# EAGLE board Base Station v3b (EAGLE 9.4.2)
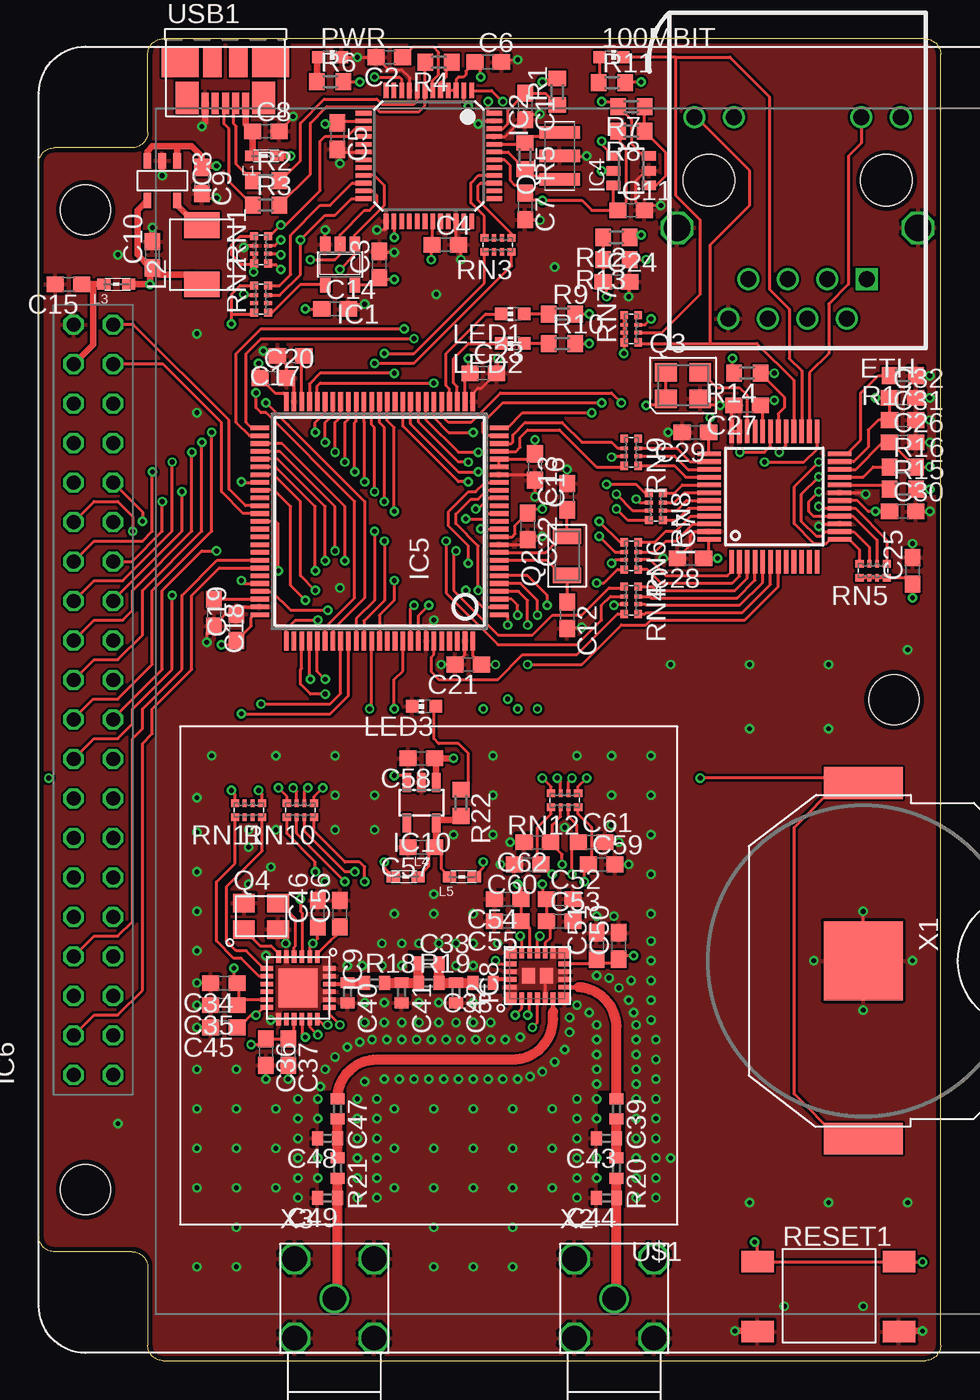
[diagram p4: board, top side]
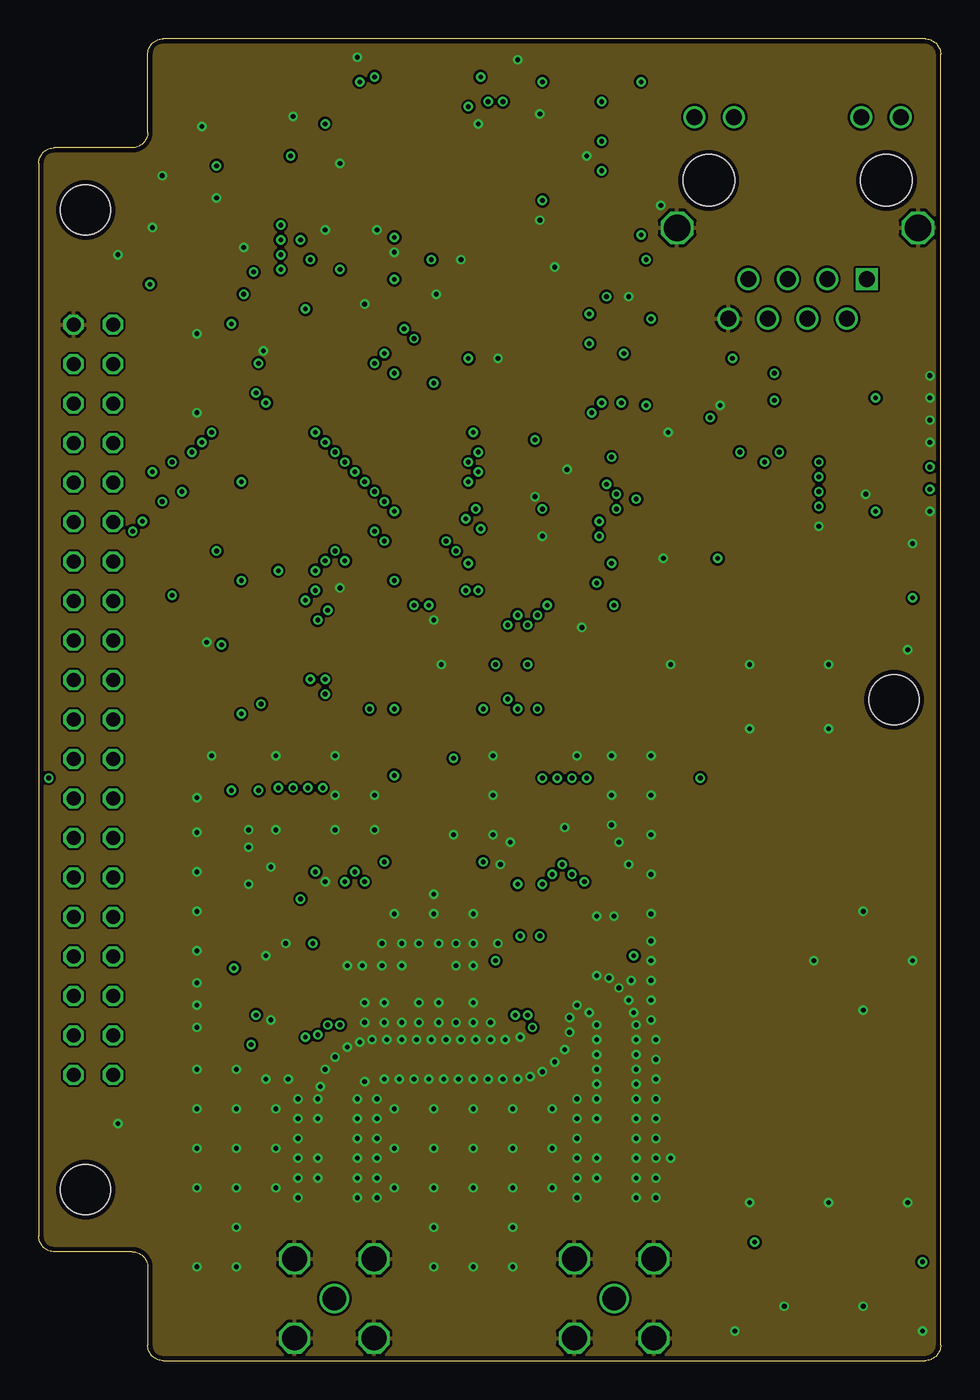
[diagram p5: board, inner layer GND]
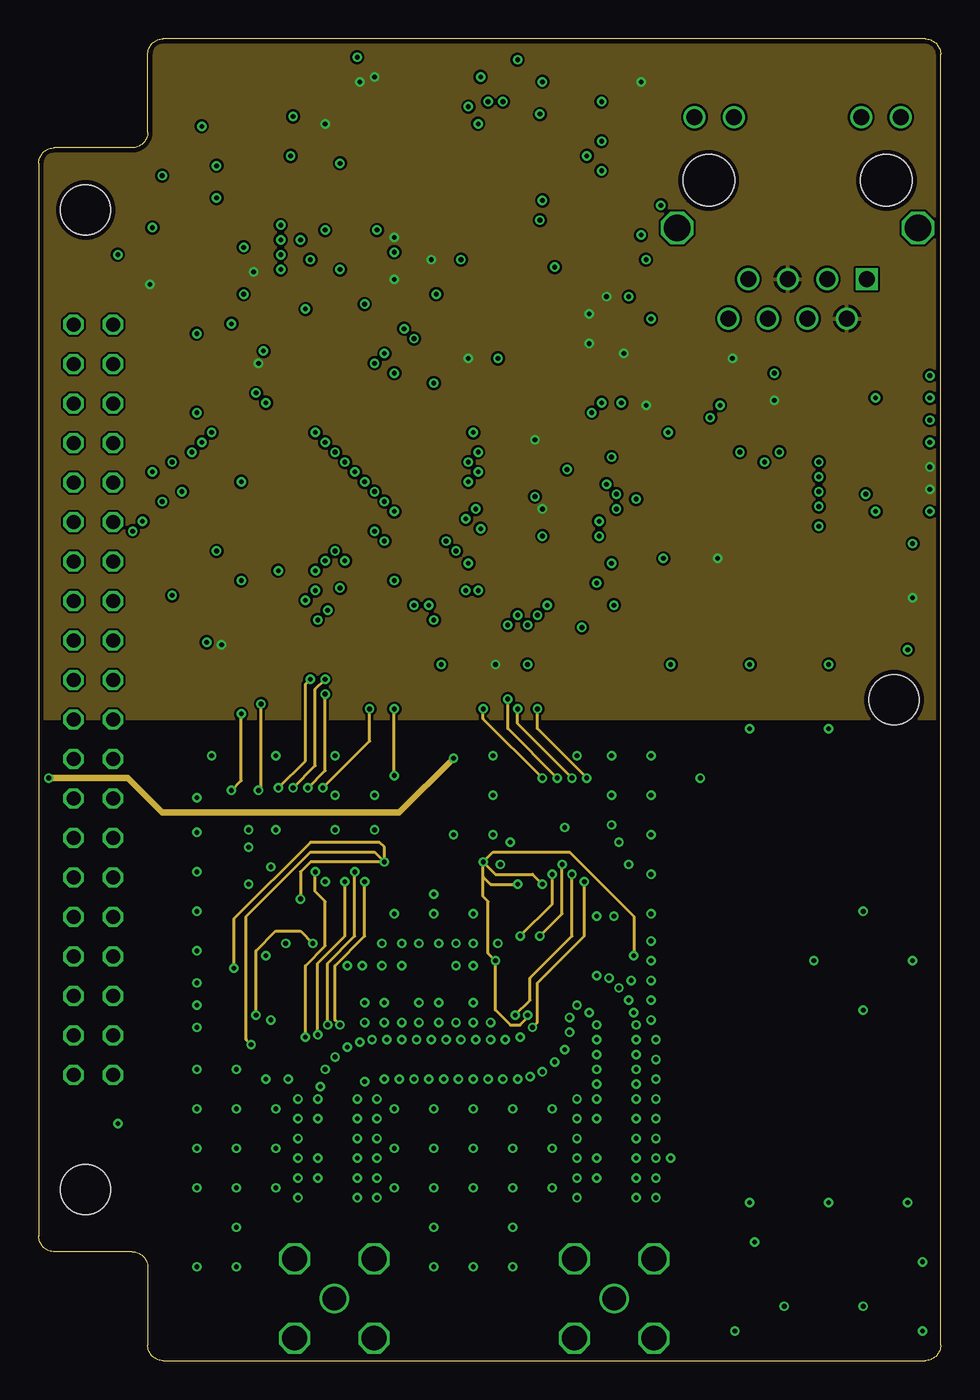
[diagram p6: board, inner layer PWR]
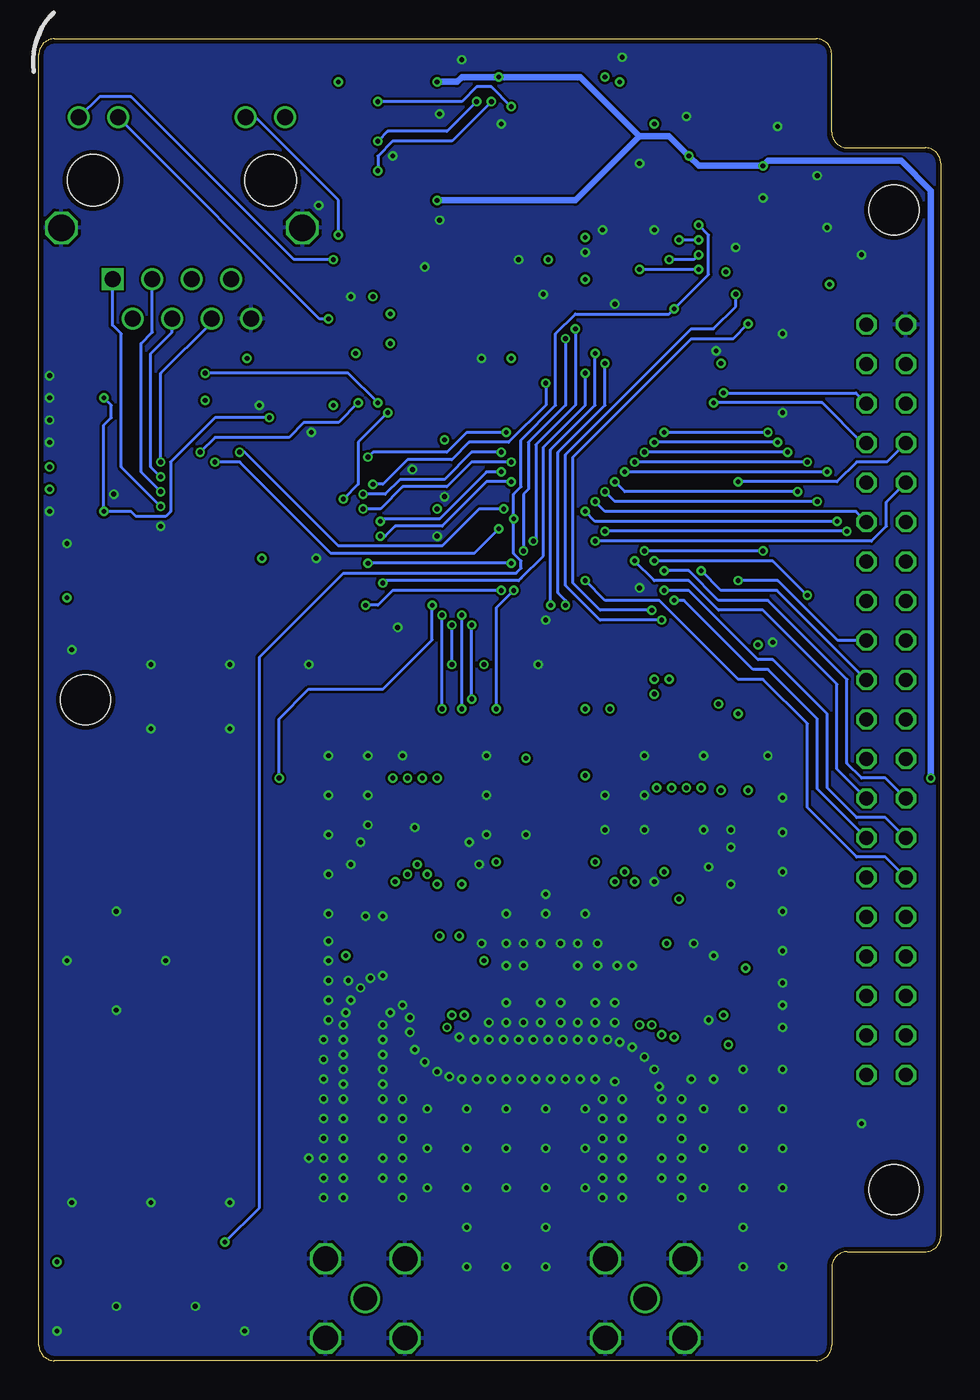
[diagram p7: board, bottom side, seen from below]

Size 58 x 85 mm. Coordinates in mm from the lower left corner, seen from the top.
Outline: 58,84 58,1 arc-90 57,0 8,0 arc-90 7,1 7,6 arc90 6,7 1,7 arc-90 0,8 0,77 arc-90 1,78 6,78 arc90 7,79 7,84 arc-90 8,85 57,85
Outline: 57,85 arc-90 58,84
Outline: 57,85 arc-90 58,84
Copper layers (1+2*15+16): HF 0.035mm / dielectric 0.38mm / GND 0.035mm / dielectric 0.71mm / PWR 0.035mm / dielectric 0.38mm / Signals 0.035mm
Design rules "PCB-POOL Standard_ML4 *": minimum track width 0.15mm, minimum drill 0.3mm, track to track 0.15mm, track to pad 0.15mm, pad to pad 0.15mm, via to via 0.15mm, smd to smd 0.15mm, copper to edge 0.3mm, drill to drill 0.2mm, minimum pad ring 0.2mm, minimum via ring 0.15mm, stop-mask expansion 0.075mm, vias tented up to drill 15mil, thermal gap 0.2mm
Net classes: 1 50Ohm: width 0.643 mm, clearance 0.35 mm
Holes 3.2 mm at 3,74 3,11 55,42.5
tKeepout: area -0.5,70.5 to 6.5,77.5; area -0.5,7.5 to 6.5,14.5; area 51.5,39 to 58.5,46
tRestrict: area 19.4,23.7 to 29.7,26.4; area 36,9.8 to 37.6,17.3; area 18.1,9.8 to 19.7,17.3

## Footprints (pad centres in the part's own frame; a part is rotated, then mirrored left to right if it is on the bottom)
CHIP-LED0603 = smd 0.8 x 0.8: A 0,-0.75; C 0,0.75
C0603 = smd 1.1 x 1: 1 -0.85,0; 2 0.85,0
C0402 = smd 0.7 x 0.9: 1 -0.65,0; 2 0.65,0
RJ45-LED = drill 1.016 square: 1 -4.445,6.35 | drill 1.016: 2 -3.175,8.89; 3 -1.905,6.35; 4 -0.635,8.89; 5 0.635,6.35; 6 1.905,8.89; 7 3.175,6.35; 8 4.445,8.89; 11 -6.629,-4.064; 12 -4.089,-4.064; 13 4.089,-4.064; 14 6.629,-4.064 | drill 1.7 octagon: 9 -7.747,3.048; 10 7.747,3.048 | hole 3.3: -5.715,0; 5.715,0
SOT23-5 = smd 0.69 x 0.99: 1 -0.95,-1.29; 2 0,-1.29; 3 0.95,-1.29; 4 0.95,1.3; 5 -0.95,1.3
LQFP48-ST = smd 1 x 0.3: 1 -4.2,2.75; 2 -4.2,2.25; 3 -4.2,1.75; 4 -4.2,1.25; 5 -4.2,0.75; 6 -4.2,0.25; 7 -4.2,-0.25; 8 -4.2,-0.75; 9 -4.2,-1.25; 10 -4.2,-1.75; 11 -4.2,-2.25; 12 -4.2,-2.75; 25 4.2,-2.75; 26 4.2,-2.25; 27 4.2,-1.75; 28 4.2,-1.25; 29 4.2,-0.75; 30 4.2,-0.25; 31 4.2,0.25; 32 4.2,0.75; 33 4.2,1.25; 34 4.2,1.75; 35 4.2,2.25; 36 4.2,2.75 | smd 0.3 x 1: 13 -2.75,-4.2; 14 -2.25,-4.2; 15 -1.75,-4.2; 16 -1.25,-4.2; 17 -0.75,-4.2; 18 -0.25,-4.2; 19 0.25,-4.2; 20 0.75,-4.2; 21 1.25,-4.2; 22 1.75,-4.2; 23 2.25,-4.2; 24 2.75,-4.2; 37 2.75,4.2; 38 2.25,4.2; 39 1.75,4.2; 40 1.25,4.2; 41 0.75,4.2; 42 0.25,4.2; 43 -0.25,4.2; 44 -0.75,4.2; 45 -1.25,4.2; 46 -1.75,4.2; 47 -2.25,4.2; 48 -2.75,4.2
SOT23-5' = smd 1.016 x 0.508: 1 -1.27,0.953; 2 -1.27,0; 3 -1.27,-0.953; 4 1.27,-0.953; 5 1.27,0.953
SOT23-6 = smd 0.6 x 0.9: 1 -0.95,-1.15; 2 0,-1.15; 3 0.95,-1.15; 4 0.95,1.15; 5 0,1.15; 6 -0.95,1.15
LQFP100-ST = smd 0.3 x 1.2: 1 -6,-7.7; 2 -5.5,-7.7; 3 -5,-7.7; 4 -4.5,-7.7; 5 -4,-7.7; 6 -3.5,-7.7; 7 -3,-7.7; 8 -2.5,-7.7; 9 -2,-7.7; 10 -1.5,-7.7; 11 -1,-7.7; 12 -0.5,-7.7; 13 0,-7.7; 14 0.5,-7.7; 15 1,-7.7; 16 1.5,-7.7; 17 2,-7.7; 18 2.5,-7.7; 19 3,-7.7; 20 3.5,-7.7; 21 4,-7.7; 22 4.5,-7.7; 23 5,-7.7; 24 5.5,-7.7; 25 6,-7.7; 51 6,7.7; 52 5.5,7.7; 53 5,7.7; 54 4.5,7.7; 55 4,7.7; 56 3.5,7.7; 57 3,7.7; 58 2.5,7.7; 59 2,7.7; 60 1.5,7.7; 61 1,7.7; 62 0.5,7.7; 63 0,7.7; 64 -0.5,7.7; 65 -1,7.7; 66 -1.5,7.7; 67 -2,7.7; 68 -2.5,7.7; 69 -3,7.7; 70 -3.5,7.7; 71 -4,7.7; 72 -4.5,7.7; 73 -5,7.7; 74 -5.5,7.7; 75 -6,7.7 | smd 1.2 x 0.3: 26 7.7,-6; 27 7.7,-5.5; 28 7.7,-5; 29 7.7,-4.5; 30 7.7,-4; 31 7.7,-3.5; 32 7.7,-3; 33 7.7,-2.5; 34 7.7,-2; 35 7.7,-1.5; 36 7.7,-1; 37 7.7,-0.5; 38 7.7,0; 39 7.7,0.5; 40 7.7,1; 41 7.7,1.5; 42 7.7,2; 43 7.7,2.5; 44 7.7,3; 45 7.7,3.5; 46 7.7,4; 47 7.7,4.5; 48 7.7,5; 49 7.7,5.5; 50 7.7,6; 76 -7.7,6; 77 -7.7,5.5; 78 -7.7,5; 79 -7.7,4.5; 80 -7.7,4; 81 -7.7,3.5; 82 -7.7,3; 83 -7.7,2.5; 84 -7.7,2; 85 -7.7,1.5; 86 -7.7,1; 87 -7.7,0.5; 88 -7.7,0; 89 -7.7,-0.5; 90 -7.7,-1; 91 -7.7,-1.5; 92 -7.7,-2; 93 -7.7,-2.5; 94 -7.7,-3; 95 -7.7,-3.5; 96 -7.7,-4; 97 -7.7,-4.5; 98 -7.7,-5; 99 -7.7,-5.5; 100 -7.7,-6
CP11009-THX = drill 0.9 octagon: 1 1.27,-24.13; 2 1.27,-21.59; 3 1.27,-19.05; 4 1.27,-16.51; 5 1.27,-13.97; 6 1.27,-11.43; 7 1.27,-8.89; 8 1.27,-6.35; 9 1.27,-3.81; 10 1.27,-1.27; 11 1.27,1.27; 12 1.27,3.81; 13 1.27,6.35; 14 1.27,8.89; 15 1.27,11.43; 16 1.27,13.97; 17 1.27,16.51; 18 1.27,19.05; 19 1.27,21.59; 20 1.27,24.13; 21 -1.27,-24.13; 22 -1.27,-21.59; 23 -1.27,-19.05; 24 -1.27,-16.51; 25 -1.27,-13.97; 26 -1.27,-11.43; 27 -1.27,-8.89; 28 -1.27,-6.35; 29 -1.27,-3.81; 30 -1.27,-1.27; 31 -1.27,1.27; 32 -1.27,3.81; 33 -1.27,6.35; 34 -1.27,8.89; 35 -1.27,11.43; 36 -1.27,13.97; 37 -1.27,16.51; 38 -1.27,19.05; 39 -1.27,21.59; 40 -1.27,24.13
LQFP48 = smd 1.5 x 0.3: 1 -4.2,2.75; 2 -4.2,2.25; 3 -4.2,1.75; 4 -4.2,1.25; 5 -4.2,0.75; 6 -4.2,0.25; 7 -4.2,-0.25; 8 -4.2,-0.75; 9 -4.2,-1.25; 10 -4.2,-1.75; 11 -4.2,-2.25; 12 -4.2,-2.75; 25 4.2,-2.75; 26 4.2,-2.25; 27 4.2,-1.75; 28 4.2,-1.25; 29 4.2,-0.75; 30 4.2,-0.25; 31 4.2,0.25; 32 4.2,0.75; 33 4.2,1.25; 34 4.2,1.75; 35 4.2,2.25; 36 4.2,2.75 | smd 0.3 x 1.5: 13 -2.75,-4.2; 14 -2.25,-4.2; 15 -1.75,-4.2; 16 -1.25,-4.2; 17 -0.75,-4.2; 18 -0.25,-4.2; 19 0.25,-4.2; 20 0.75,-4.2; 21 1.25,-4.2; 22 1.75,-4.2; 23 2.25,-4.2; 24 2.75,-4.2; 37 2.75,4.2; 38 2.25,4.2; 39 1.75,4.2; 40 1.25,4.2; 41 0.75,4.2; 42 0.25,4.2; 43 -0.25,4.2; 44 -0.75,4.2; 45 -1.25,4.2; 46 -1.75,4.2; 47 -2.25,4.2; 48 -2.75,4.2
SMCM-22 = smd 0.75 x 0.75: 1 -1.475,1.725; 7 -1.475,-1.725; 12 1.475,-1.725; 18 1.475,1.725 | smd 0.75 x 0.3: 2 -1.475,1; 3 -1.475,0.5; 4 -1.475,0; 5 -1.475,-0.5; 6 -1.475,-1; 13 1.475,-1; 14 1.475,-0.5; 15 1.475,0; 16 1.475,0.5; 17 1.475,1 | smd 0.3 x 0.75: 8 -0.75,-1.725; 9 -0.25,-1.725; 10 0.25,-1.725; 11 0.75,-1.725; 19 0.75,1.725; 20 0.25,1.725; 21 -0.25,1.725; 22 -0.75,1.725 | smd 1 x 0.85: PAD1 0,0.575; PAD2 0,-0.575
QFN24L = smd 0.8 x 0.3: 1 -2,1.25; 2 -2,0.75; 3 -2,0.25; 4 -2,-0.25; 5 -2,-0.75; 6 -2,-1.25; 13 2,-1.25; 14 2,-0.75; 15 2,-0.25; 16 2,0.25; 17 2,0.75; 18 2,1.25 | smd 0.3 x 0.8: 7 -1.25,-2; 8 -0.75,-2; 9 -0.25,-2; 10 0.25,-2; 11 0.75,-2; 12 1.25,-2; 19 1.25,2; 20 0.75,2; 21 0.25,2; 22 -0.25,2; 23 -0.75,2; 24 -1.25,2 | smd 2.5 x 2.5: PAD 0,0
SOT23-5L = smd 0.55 x 1.2: 1 -0.95,-1.3; 2 0,-1.3; 3 0.95,-1.3; 4 0.95,1.3; 5 -0.95,1.3
0603 = smd 0.85 x 0.7: 1 -0.9,0; 2 0.7,0
IHLP1616 = smd 1.651 x 2.286: P$1 -1.905,0; P$2 1.905,0
CSTCR6M = smd 0.8 x 2.6: 1 -1.5,0; 2 0,0; 3 1.5,0
CRYSTAL-07W = smd 1 x 1.8: 1 -1.25,0; 2 1.25,0
7X = smd 1.4 x 1.2: 1 -1.1,-0.85; 2 1.1,-0.85; 3 1.1,0.85; 4 -1.1,0.85
CRYSTAL-7M = smd 1.4 x 1.2: 1 -1.1,-0.85; 2 1.1,-0.85; 3 1.1,0.85; 4 -1.1,0.85
R0603 = smd 1 x 1.1: 1 -0.85,0; 2 0.85,0
R0402 = smd 0.7 x 0.9: 1 -0.65,0; 2 0.65,0
BUTTON4 = smd 1.4 x 2.1: 1 4.5,9.1; 2 4.5,0; 3 0,9.1; 4 0,0
EXB28V = smd 0.525 x 0.5: 1 -0.875,-0.45; 4 0.875,-0.45; 5 0.875,0.45; 8 -0.875,0.45 | smd 0.25 x 0.5: 2 -0.25,-0.45; 3 0.25,-0.45; 6 0.25,0.45; 7 -0.25,0.45
USB-BMICRO = smd 0.45 x 1.38: 1 1.3,-2.66; 2 0.65,-2.66; 3 0,-2.66; 4 -0.65,-2.66; 5 -1.3,-2.66 | smd 1.175 x 1.9: P$1 0.838,0; P$2 -0.838,0 | smd 2.375 x 1.9: P$3 2.913,0; P$4 -2.913,0 | smd 1.475 x 2.1: P$5 -2.462,-2.3; P$6 2.462,-2.3
CR2025 = smd 5.08 x 5.08: GND 0,0 | smd 2.032 x 5.08: POS1 -11.43,0; POS2 11.43,0
ANT-SMA-RA = drill 1.5: C 0,0 | drill 1.6 octagon: GND1 -2.55,2.55; GND2 2.55,2.55; GND3 2.55,-2.55; GND4 -2.55,-2.55

## Placement (x,y rotation side)
100MBIT  gr  [CHIP-LED0603]  36.83,83.82 270 top
C1  100n  [C0603]  31.27,80.64 270 top
C2  100n  [C0603]  22.54,83.82 180 top
C3  100n  [C0603]  21.91,70.48 90 top
C4  100n  [C0603]  26.15,71.75 0 top
C5  100n  [C0603]  19.21,78.74 270 top
C6  100n  [C0603]  28.89,83.5 0 top
C7  100n  [C0603]  31.27,74.22 270 top
C8  100n  [C0603]  14.61,79.06 0 top
C9  10u  [C0603]  10.48,75.88 270 top
C10  10u  [C0603]  7.3,71.12 90 top
C11  100n  [C0603]  38.1,73.98 0 top
C12  3p  [C0603]  33.97,47.94 270 top
C13  3p  [C0603]  33.97,55.56 90 top
C14  100n  [C0603]  19.05,67.63 0 top
C15  10u  [C0603]  1.91,69.22 180 top
C16  100n  [C0603]  31.91,57.47 270 top
C17  10u  [C0603]  16.19,64.61 180 top
C18  10u  [C0603]  11.27,48.1 270 top
C19  100n  [C0603]  12.7,47.15 90 top
C20  100n  [C0603]  15.08,63.18 0 top
C21  100n  [C0603]  27.62,44.77 180 top
C22  100n  [C0603]  31.43,53.66 270 top
C23  100n  [C0603]  28.57,63.5 0 top
C24  100n  [C0603]  37.15,69.37 0 top
C25  100n  [C0603]  56.2,50.8 90 top
C26  100n  [C0603]  55.56,59.05 0 top
C27  100n  [C0603]  45.56,61.44 180 top
C28  100n  [C0603]  41.91,51.59 180 top
C29  100n  [C0603]  42.23,59.69 180 top
C30  100n  [C0603]  55.56,54.61 0 top
C31  100n  [C0603]  55.56,60.48 0 top
C32  10u  [C0603]  55.56,61.91 0 top
C33  0p5  [C0402]  25.08,25.56 0 top
C34  100n  [C0603]  11.91,24.29 180 top
C35  1n  [C0603]  11.91,22.86 180 top
C36  100n  [C0603]  14.61,19.84 270 top
C37  1n  [C0603]  16.03,19.84 270 top
C38  100p  [C0402]  28.58,24.29 180 top
C39  47p  [C0402]  37.15,16.19 270 top
C40  NA  [C0402]  19.84,23.65 270 top
C41  1p2  [C0402]  23.34,23.65 270 top
C42  1p2  [C0402]  26.83,23.65 270 top
C43  NA  [C0402]  36.51,14.29 180 top
C44  0p5  [C0402]  36.51,10.48 180 top
C45  1u  [C0603]  11.91,21.43 180 top
C46  10n  [C0603]  17.94,28.73 90 top
C47  47p  [C0402]  19.21,16.19 270 top
C48  NA  [C0402]  18.57,14.29 180 top
C49  0p7  [C0402]  18.57,10.48 180 top
C50  100n  [C0603]  37.31,26.67 90 top
C51  1n  [C0603]  35.88,26.67 90 top
C52  100n  [C0603]  33.5,29.69 0 top
C53  1n  [C0603]  33.5,28.26 0 top
C54  100n  [C0603]  30.16,29.69 180 top
C55  1n  [C0603]  30.16,28.26 180 top
C56  10n  [C0603]  19.37,28.73 90 top
C57  10u  [C0603]  24.61,33.02 180 top
C58  10u  [C0603]  24.61,38.73 180 top
C59  1n  [C0603]  36.2,31.91 0 top
C60  1n  [C0603]  31.43,31.91 180 top
C61  1n  [C0603]  35.56,33.34 0 top
C62  1n  [C0603]  32.07,33.34 180 top
ETH  SI-60062-F  [RJ45-LED]  48.8,75.9 180 top
IC1  74LVC1G125DBV  [SOT23-5]  19.37,70.48 180 top
IC2  FT2232ST  [LQFP48-ST]  25.08,77.47 270 top
IC3  SC189-3.3  [SOT23-5']  7.94,75.88 270 top
IC4  93C76B  [SOT23-6]  38.1,76.52 90 top
IC5  STM32F767VIT6  [LQFP100-ST]  21.91,53.98 90 top
IC6  CP11009  [CP11009-THX]  3.5,42.5 180 top
IC7  DP83848CVV  [LQFP48]  47.31,55.56 90 top
IC8  SKY66112  [SMCM-22]  32.07,24.77 90 top
IC9  SX1280  [QFN24L]  16.67,23.97 270 top
IC10  LP5907MFX-3.3  [SOT23-5L]  24.61,35.88 180 top
L1  120R  [0603]  14.61,77.47 0 top
L2  2u2  [IHLP1616]  10.48,71.12 90 top
L3  120R  [0603]  5.08,69.22 0 top
L4  120R  [0603]  23.5,31.11 180 top
L5  120R  [0603]  27.3,31.11 0 top
LED1  rd  [CHIP-LED0603]  30.48,67.31 90 top
LED2  gr  [CHIP-LED0603]  30.48,65.41 90 top
LED3  gr  [CHIP-LED0603]  24.77,42.07 90 top
PWR  gr  [CHIP-LED0603]  18.73,83.82 270 top
Q1  CSTCR6M00G55-R0  [CSTCR6M]  33.5,77.47 90 top
Q2  ABS07W-32.768KHZ  [CRYSTAL-07W]  33.97,51.75 90 top
Q3  25MHz  [7X]  41.43,62.71 0 top
Q4  FL520WFMT1  [CRYSTAL-7M]  14.29,28.57 0 top
R1  1k  [R0603]  33.34,81.6 90 top
R2  33  [R0603]  14.61,75.88 0 top
R3  33  [R0603]  14.61,74.3 0 top
R4  1k5  [R0603]  25.72,83.5 180 top
R5  1M  [R0603]  31.27,77.47 270 top
R6  1k  [R0603]  18.73,82.23 0 top
R7  1k  [R0603]  38.1,80.64 180 top
R8  4k87  [R0603]  38.1,79.06 180 top
R9  1k  [R0603]  33.66,67.31 0 top
R10  1k  [R0603]  33.66,65.41 0 top
R11  1k  [R0603]  36.86,82.19 0 top
R12  1k  [R0603]  37.15,72.23 180 top
R13  1k  [R0603]  37.15,70.8 180 top
R14  1k5  [R0603]  45.56,63.5 180 top
R15  2k2  [R0603]  55.56,56.04 0 top
R16  2k2  [R0603]  55.56,57.47 0 top
R17  4k87  [R0603]  55.56,63.34 180 top
R18  3n  [R0402]  21.59,24.29 0 top
R19  2n4  [R0402]  25.08,24.29 0 top
R20  2n4  [R0402]  37.15,12.38 270 top
R21  3n  [R0402]  19.21,12.38 270 top
R22  1k  [R0603]  27.15,35.88 270 top
RESET1  BUTTON4  [BUTTON4]  46.22,6.37 270 top
RN1  10k  [EXB28V]  14.29,71.44 90 top
RN2  100  [EXB28V]  14.29,68.26 90 top
RN3  100  [EXB28V]  29.53,71.75 180 top
RN4  100  [EXB28V]  38.1,48.9 270 top
RN5  100  [EXB28V]  53.66,50.8 180 top
RN6  100  [EXB28V]  38.1,51.75 270 top
RN7  N/A  [EXB28V]  38.1,66.36 90 top
RN8  100  [EXB28V]  39.69,54.93 270 top
RN9  100  [EXB28V]  38.1,58.42 270 top
RN10  100  [EXB28V]  16.83,35.4 180 top
RN11  100  [EXB28V]  13.49,35.4 180 top
RN12  100  [EXB28V]  33.81,36.04 180 top
U$1  BMI-S-204-F  [SHIELD-32MM]  25.08,24.77 180 top
USB1  USB-BU  [USB-BMICRO]  12,83.5 0 top
X1  3034TR  [CR2025]  53.02,25.72 270 top
X2  [ANT-SMA-RA]  37,4 0 top
X3  [ANT-SMA-RA]  19,4 0 top

## Tracks (layer width: path | path; a pad name or v marks a point on that pad's centre or on a via)
25MHZ  (via drill 0.3)
  HF 0.203: IC5.12 28.44,53.48 v28.42,53.5 | v46.67,57.78 49.21,57.78 50.06,58.63 IC7.25
  Signals 0.203: v28.42,53.5 30,51.91 39.21,51.91 45.09,57.78 v46.67,57.78
+3V3  (via drill 0.3)
  HF 0.203: IC7.22 52.55,57.31 54.29,59.05 C26.1 54.77,59.05 56.36,57.47 R16.2 v57.31,57.47 | IC7.48 43.11,51.62 C28.1 | C28.1 v43.66,51.59 | C28.1 | v36.51,68.42 36.51,68.84 C24.1 R13.2 R12.2 | v47.31,61.75 46.73,61.75 C27.1 46.56,61.29 IC7.32 | v37.62,64.77 37.62,65.46 RN7.8 RN7.7 RN7.6 RN7.5 | Q3.4 Q3.1 39.91,61.44 v39.05,61.44 | C25.1 56.09,50.16 | C25.1 56.28,50.03 56.4,49.91 | IC2.10 23.33,82.39 23.18,82.55 | IC2.14 19.44,79.72 C5.1 | C5.1 19.37,79.67 | IC2.31 25.33,71.79 C4.1 25.24,71.69 v25.24,70.8 | IC2.26 22.86,73.24 v22.86,72.23 | 23.18,82.55 | v21.59,82.55 23.18,82.55 | R15.2 v57.31,56.04 | R9.2 v35.4,67.31 | R10.2 v35.4,65.41 | C5.1 19.38,79.69 | v18.41,79.53 19.15,79.53 C5.1 | RN1.5 12.94,72.31 12.38,71.75 12.38,71.12 13.02,70.48 13.76,70.48 | 13.76,70.48 RN1.8 RN1.7 | 13.76,70.48 13.81,70.43 v13.81,70.01 | IC1.5 21.46,69.19 C3.1 22.01,69.53 v22.86,69.53 | v44.61,64.45 44.61,63.6 R14.2 | C16.1 31.57,57.98 IC5.21 IC5.20 | C16.1 | C16.1 v31.91,59.21 | IC5.11 30.43,52.98 30.64,53.18 30.64,53.71 C22.1 31.54,54.77 v32.38,54.77 | IC5.75 13.84,47.98 13.65,47.78 13.65,47.25 C19.1 12.44,46.04 v11.75,46.04 | IC5.50 15.91,62.04 15.72,62.23 15.18,62.23 C20.1 14.13,63.28 v14.13,64.14 | IC5.27 27.41,63.18 C23.1 27.62,63.6 v27.62,64.45 | C25.1 v56.2,49.05 | IC5.100 27.91,45.33 C21.1 v29.37,44.77 | R11.2 37.75,82.23 v38.73,82.23 | C25.1 55.8,50.35 RN5.8 RN5.7 RN5.6 RN5.5 | R6.2 v20.64,82.23
  HF 0.406: L2.P$1 9.84,69.85 7.72,69.85 C10.1 | C10.1 7.2,70.27 6.35,71.12 6.35,73.98 IC3.4 | C10.1 7.14,70.11 v7.14,69.22 L3.2 | L3.2
  pour PWR: 0,85.09 58.74,85.09 58.74,41.27 0,41.27
+5V  (via drill 0.3)
  HF 0.203: IC2.42 29.94,77.22 30.32,76.83 30.32,75.88 30.64,75.56 30.77,75.56 C7.1 31.72,74.61 v32.38,74.61 34.92,74.61 35.56,73.98 C11.1 | IC2.4 IC2.3 26.83,82.39 26.99,82.55 27.3,82.55 27.46,82.71 27.46,82.92 C6.1 28.42,83.13 v28.42,82.55 | IC4.6 36.95,74.28 C11.1 | C11.1 37.78,74.51 37.78,77.95 37.41,78.32 37.41,78.9 R8.2
  HF 0.406: C7.1 31.56,74.77 | 33.23,82.23 R1.2 33.12,82.23 v32.38,82.23 | v26.67,38.73 C58.1 25.56,38.63 IC10.1 | v16.19,77.47 L1.2 | IC3.3 6.99,77.79 7.3,78.11 8.89,78.11 | 8.89,78.11 9.84,78.11 10.48,77.47 C9.1 10.58,76.83 v11.43,76.83 | 8.89,78.11 IC3.1
  PWR 0.406: v26.67,38.73 23.18,35.24 7.94,35.24 5.71,37.47 v0.64,37.47
  Signals 0.406: v32.38,82.23 31.11,82.23 30.8,82.55 v28.42,82.55 | v28.42,82.55 | v28.42,82.55 23.18,82.55 19.37,78.74 | 19.37,78.74 17.46,78.74 v16.19,77.47 15.56,76.83 v11.43,76.83 11.11,77.15 2.54,77.15 0.64,75.25 v0.64,37.47 | v32.38,74.61 23.5,74.61 19.37,78.74
ANTS  (via drill 0.3)
  HF 0.203: IC8.4 32.07,21.75 v31.75,21.43 | v35.08,30.8 35.08,31.61 C59.1 35.56,31.61 35.56,34.29 34.69,35.16 RN12.8
  PWR 0.203: v31.75,21.43 32.07,21.75 32.07,24.29 35.08,27.3 v35.08,30.8
CPS  (via drill 0.3)
  HF 0.203: IC8.15 32.07,27.15 v32.23,27.3 | v33.66,31.91 33.66,32.56 C62.1 33.02,33.35 33.02,34.45 33.56,34.99 RN12.6
  PWR 0.203: v32.23,27.3 33.66,28.73 v33.66,31.91
CRX  (via drill 0.3)
  HF 0.203: IC8.2 31.07,22.65 v30.64,22.23 | v34.29,31.27 34.29,33.03 C61.1 34.61,33.35 34.61,34.45 34.06,34.99 RN12.7
  PWR 0.203: v30.64,22.23 31.59,23.18 31.59,24.61 34.29,27.3 v34.29,31.27
CTX  (via drill 0.3)
  HF 0.203: IC8.17 31.07,27.19 v30.96,27.3 | v33.02,31.27 33.02,31.29 C60.1 32.07,31.61 32.07,34.29 32.94,35.16 RN12.5
  PWR 0.203: v30.96,27.3 33.02,29.37 v33.02,31.27
FMC_A16  (via drill 0.3)
  HF 0.203: IC5.58 13.06,56.48 v13.02,56.52
  Signals 0.203: v13.02,56.52 6.67,56.52 5.4,57.78 3.46,57.78 IC6.4
FMC_D0
  HF 0.203: IC5.61 13.29,54.98 12.22,56.04 12.22,60.48 6.08,66.63 IC6.21
FMC_D1
  HF 0.203: IC5.62 13.15,54.48 11.75,55.88 11.75,60.33 7.98,64.09 IC6.22
FMC_D2  (via drill 0.3)
  HF 0.203: IC5.81 18.41,47.14 19.53,48.26 20.32,49.05 20.32,55.24 14.61,60.96 14.29,60.96 13.97,61.28 v13.97,62.23
  Signals 0.203: v13.97,62.23 5.45,62.23 IC6.23
FMC_D3  (via drill 0.3)
  HF 0.203: IC5.82 18.91,47.01 20.95,49.05 20.95,55.24 16.83,59.37 | 16.83,59.37 | 16.03,60.17 16.83,59.37 | 16.03,60.17 | v14.61,61.59 16.03,60.17
  Signals 0.203: IC6.24 5.04,59.01 7.62,61.59 v14.61,61.59
FMC_D4  (via drill 0.3)
  HF 0.203: IC5.37 22.41,60.46 22.86,60.01 v22.86,54.61 | v6.67,53.98 6.67,54.57 IC6.25
  Signals 0.203: v22.86,54.61 22.23,53.98 v6.67,53.98
FMC_D5  (via drill 0.3)
  HF 0.203: IC5.38 21.91,60.33 22.23,60.01 v22.23,55.24
  Signals 0.203: v22.23,55.24 21.59,54.61 5.45,54.61 IC6.26
FMC_D6  (via drill 0.3)
  HF 0.203: IC5.39 21.41,60.19 21.59,60.01 v21.59,55.88 | IC6.27 5.99,51.39 7.94,53.34 v7.94,55.24
  Signals 0.203: v21.59,55.88 20.95,55.24 v7.94,55.24
FMC_D7  (via drill 0.3)
  HF 0.203: IC5.40 20.91,60.37 20.95,60.33 v20.95,56.52 | IC6.28 4.82,48.9 4.76,48.9 9.21,53.34 v9.21,55.88
  Signals 0.203: v20.95,56.52 20.32,55.88 v9.21,55.88
FMC_D8  (via drill 0.3)
  HF 0.203: IC5.41 20.41,60.41 20.32,60.33 v20.32,57.15 | IC6.7 3.54,52.7 6.67,52.7 7.3,53.34 v7.3,57.15
  Signals 0.203: v7.3,57.15 v20.32,57.15
FMC_D9  (via drill 0.3)
  HF 0.203: IC5.42 19.91,60.55 19.68,60.33 v19.68,57.78 | IC6.8 3.54,50.16 5.4,50.16 8.57,53.34 v8.57,57.78
  Signals 0.203: v8.57,57.78 v19.68,57.78
FMC_D10  (via drill 0.3)
  HF 0.203: IC5.43 19.41,60.68 19.05,60.33 v19.05,58.42 | IC6.9 3.54,47.62 5.4,47.62 6.03,48.26 6.03,49.53 9.84,53.34 v9.84,58.42
  Signals 0.203: v9.84,58.42 v19.05,58.42
FMC_D11  (via drill 0.3)
  HF 0.203: IC5.44 18.91,60.82 18.41,60.33 v18.41,59.05 | IC6.10 3.54,45.09 5.08,45.09 6.67,46.67 6.67,49.53 10.48,53.34 v10.48,59.05
  Signals 0.203: v10.48,59.05 v18.41,59.05
FMC_D12  (via drill 0.3)
  HF 0.203: IC5.45 18.41,60.95 17.78,60.33 v17.78,59.69 | IC6.11 2.23,41.28 3.49,42.55 5.08,42.55 7.3,44.77 7.3,49.53 11.11,53.34 v11.11,59.69
  Signals 0.203: v11.11,59.69 v17.78,59.69
FMC_D13  (via drill 0.3)
  HF 0.203: IC5.55 15.37,57.98 18.41,54.93 v18.41,51.44 | v8.57,49.21 8.57,44.45 6.03,41.91 6.03,40.96 5.08,40.01 3.54,40.01 IC6.12
  Signals 0.203: v18.41,51.44 10.79,51.44 v8.57,49.21
FMC_D14  (via drill 0.3)
  HF 0.203: IC5.56 15.23,57.48 17.78,54.93 v17.78,50.8
  Signals 0.203: v17.78,50.8 16.19,50.8 14.29,48.9 11.11,48.9 6.03,43.81 6.03,38.42 5.08,37.47 3.54,37.47 IC6.13
FMC_D15  (via drill 0.3)
  HF 0.203: IC5.57 15.1,56.98 16.83,55.24 16.83,50.48 v17.78,49.53
  Signals 0.203: v17.78,49.53 16.19,49.53 11.75,45.09 10.79,45.09 7.3,41.59 7.3,36.83 5.4,34.92 3.54,34.92 IC6.14
FMC_NE1  (via drill 0.3)
  HF 0.203: IC5.88 21.91,47.94 22.86,48.9 v22.86,50.16
  Signals 0.203: v22.86,50.16 21.59,48.9 18.1,48.9 13.02,43.81 11.43,43.81 8.57,40.96 8.57,35.56 5.4,32.38 3.54,32.38 IC6.15
FMC_NOE  (via drill 0.3)
  HF 0.203: IC5.85 20.41,47.71 21.59,48.9 v21.59,53.34 | v6.03,53.34 6.03,54.29 5.08,55.24 3.54,55.24 IC6.6
  Signals 0.203: v6.03,53.34 v21.59,53.34
FMC_NWE  (via drill 0.3)
  HF 0.203: IC5.86 20.91,47.58 22.23,48.9 v22.23,52.7
  Signals 0.203: v22.23,52.7 4.45,52.7 3.49,53.66 3.49,55.21 IC6.5
GND  (via drill 0.3)
  HF 0.203: IC9.13 14.99,21.97 v14.92,21.91 | IC7.19 53.09,55.81 v53.18,55.72 | v40.16,51.59 41.38,51.59 C28.2 41.91,52.44 41.91,53.02 42.2,53.31 IC7.47 | v40.48,59.69 C29.2 | C27.2 44.56,61.28 IC7.36 IC7.35 | C27.2 | C27.2 v43.81,61.44 42.95,61.44 Q3.2 | C25.2 56.09,51.75 56.2,51.85 v56.2,52.55 | IC2.45 29.98,78.72 31.06,79.8 C1.2 31.33,80.17 v32.23,80.17 | IC2.18 19.61,77.72 C5.2 19.37,77.94 v19.37,76.99 | Q1.2 v35.24,77.47 | Q1.2 | IC2.47 28.44,79.72 v28.26,79.53 | C7.2 32.2,73.36 v32.23,73.34 | IC2.34 26.83,71.92 C4.2 27.15,71.6 v27.15,70.8 | v21.75,72.71 22.26,72.71 22.33,72.78 IC2.25 | 29.53,83.24 C6.2 29.9,83.66 v30.8,83.66 | R17.1 | R17.1 v57.31,63.34 | C32.2 v57.31,61.91 | C31.2 | C31.2 v57.31,60.48 | C26.2 | C26.2 v57.31,59.05 | C30.2 | C30.2 v57.31,54.61 | IC8.5 32.57,24.69 IC8.PAD2 | IC2.9 23.83,82.53 23.34,83.03 22.49,83.03 C2.2 v20.48,83.82 PWR.C | IC5.10 31.1,52.48 C22.2 31.49,53.02 v32.38,53.02 | IC5.19 31.55,56.98 C16.2 v31.91,55.56 | IC5.49 16.41,62.71 C20.2 15.93,64.02 C17.2 15.03,64.93 v14.45,64.93 | IC1.3 v18.41,72.71 | C14.2 20.22,67.94 v20.95,67.94 | v37.94,68.42 37.94,69.32 C24.2 | IC7.15 50.32,53.81 v50.16,53.66 | IC5.26 27.91,62.2 28.26,62.55 28.47,62.55 C23.2 29.53,63.6 v29.53,64.45 | C13.2 v33.97,57.31 | C12.2 34.03,47.15 v34.92,47.15 | IC5.99 27.41,45.4 C21.2 v25.88,44.77 | IC5.94 24.91,47.13 v25.4,47.62 | IC5.74 13.18,48.48 C19.2 12.02,48 C18.2 10.79,46.77 v10.79,46.2 | IC4.2 39.05,76.52 38.42,75.88 38.42,74.51 C11.2 39.27,74.3 v40.01,74.3 | C8.2 16.35,79.95 v16.35,80.01 | C9.2 10.74,74.77 v11.43,74.77 | C3.2 21.96,71.28 v22.86,71.28 | RN1.6 13.27,71.69 v13.18,71.6 | X1.GND v53.02,28.89
  HF 0.406: IC3.2 v7.94,76.2 | C10.2 v7.3,72.87 | RESET1.2 46.19,1.91 v44.77,1.91 | v56.83,1.91 55.36,1.91 RESET1.1 | USB1.5 10.7,79.6 v10.48,79.38
  other vias: 15.88,26.83 14.61,26.03 29.69,31.91 37.94,31.91 37.31,33.34 30.32,33.34 18.41,30.8 35.88,16.83 13.49,34.13 13.49,33.02 33.81,34.29 50.8,44.77 35.88,15.56 35.88,13.02 35.88,11.75 34.61,16.83 34.61,15.56 34.61,14.29 34.61,13.02 34.61,11.75 34.61,10.48 38.42,16.83 38.42,15.56 38.42,14.29 38.42,13.02 38.42,11.75 38.42,10.48 39.69,10.48 39.69,11.75 39.69,13.02 40.64,13.02 39.69,14.29 39.69,15.56 39.69,16.83 20.48,16.83 20.48,15.56 20.48,14.29 20.48,13.02 20.48,11.75 20.48,10.48 21.75,10.48 21.75,11.75 21.75,13.02 21.75,14.29 21.75,15.56 21.75,16.83 17.94,16.83 17.94,15.56 17.94,13.02 17.94,11.75 16.67,16.83 16.67,15.56 16.67,14.29 16.67,13.02 16.67,11.75 16.67,10.48 39.69,18.1 39.69,19.37 39.69,20.64 39.37,21.91 39.37,23.18 39.37,24.45 38.1,24.45 39.37,25.72 38.42,17.78 38.42,18.73 38.42,19.68 38.42,20.64 38.42,21.59 35.88,17.78 35.88,18.73 35.88,19.68 35.88,20.64 35.88,21.59 35.4,22.38 34.61,22.86 38.26,22.38 37.94,23.18 37.31,23.97 36.67,24.61 35.88,24.77 26.99,18.1 27.94,18.1 28.89,18.1 29.84,18.1 30.8,18.1 31.59,18.26 32.38,18.57 33.18,19.21 33.81,20 34.13,21.11 34.13,22.07 26.19,20.64 27.15,20.64 28.1,20.64 29.05,20.64 30,20.64 30.96,20.8 26.04,18.1 25.08,18.1 24.13,18.1 23.18,18.1 22.23,18.1 20.95,17.94 25.24,20.64 24.29,20.64 23.34,20.64 22.38,20.64 21.43,20.64 20.64,20.48 19.84,20.16 19.05,19.53 18.41,18.73 18.1,17.62 27.94,13.65 25.4,13.65 33.02,11.11 30.48,11.11 30.48,8.57 30.48,6.03 27.94,6.03 25.4,8.57 25.4,6.03 27.94,11.11 25.4,11.11 12.7,11.11 12.7,8.57 12.7,6.03 10.16,6.03 12.7,13.65 10.16,11.11 22.86,11.11 22.86,13.65 22.86,16.19 25.4,16.19 30.48,13.65 33.02,13.65 33.02,16.19 30.48,16.19 27.94,16.19 15.24,11.11 15.24,13.65 10.16,13.65 10.16,16.19 12.7,16.19 15.24,16.19 16.03,18.1 14.61,18.1 12.7,18.73 10.16,18.73 25.72,23.02 24.45,23.02 22.22,23.02 20.95,23.02 27.94,23.02 26.83,25.4 27.94,25.4 23.34,25.4 22.07,25.4 20.8,25.4 19.84,25.4 23.34,26.83 26.83,26.83 24.45,26.83 25.72,26.83 27.94,26.83 29.53,26.83 22.07,26.83 27.94,21.75 29.05,21.75 25.72,21.75 24.45,21.75 22.22,21.75 20.95,21.75 23.34,21.75 26.83,21.75 10.16,26.35 10.16,28.89 10.16,31.43 10.16,33.97 10.16,36.2 39.37,26.99 25.4,28.73 22.86,28.73 25.4,30 27.94,28.73 35.88,28.58 39.37,28.73 39.37,31.27 39.37,33.81 39.37,36.35 39.37,38.89 36.83,38.89 34.61,38.89 36.83,36.35 36.83,34.45 29.21,33.81 29.21,36.35 29.21,38.89 26.67,33.81 21.59,34.13 19.05,34.13 21.59,36.35 19.05,36.35 19.05,38.89 14.92,31.75 13.49,30.64 15.24,34.13 10.16,21.43 10.16,22.86 10.16,24.29 53.02,3.49 47.94,3.49 36.99,28.58 49.85,25.72 53.02,22.54 56.2,25.72 19.37,49.69 45.72,44.77 55.88,45.72 50.8,40.64 45.72,40.64 40.64,44.77 25.56,68.58 33.18,70.33 10.16,66.04 5.08,71.12 10.16,60.96 5.08,15.24 45.72,10.16 50.8,10.16 55.88,10.16 15.24,38.89 11.11,38.89
  pour GND: 0,0 85.09,0 85.09,85.09 0,85.09
  pour HF (rank 2): 0,85.09 58.41,85.09 58.41,0 0,0
  pour Signals: 0,0 0,85.09 58.09,85.09 58.09,0
  pour HF (no thermals): 14.61,26.04 18.73,26.04 18.73,21.91 14.61,21.91
  pour HF (no thermals): 30.16,26.35 30.16,23.18 33.97,23.18 33.97,26.35
JTD-A2M1  (via drill 0.3)
  HF 0.203: IC2.23 21.46,75.22 21.75,74.93 21.75,74.45 21.27,73.98 20.95,73.98 19.37,72.39 IC1.2 19.37,71.12 19.05,70.8 v17.46,70.8 | RN1.2 15.49,71.19 v15.56,71.12
  Signals 0.203: v15.56,71.12 15.88,70.8 v17.46,70.8
JTD-M2A1
  HF 0.203: IC2.22 20.16,75.72 18.73,74.3 18.1,74.3 16.19,72.39 16.19,69.85 15.48,69.14 RN2.4
LCD_ON
  HF 0.203: IC5.69 11.61,50.98 9.84,49.21 9.84,44.45 7.3,41.91 7.3,40.32 6.67,39.69 6.67,23.81 5.08,22.23 3.54,22.23 IC6.19
LCD_RESET
  HF 0.203: IC5.68 11.47,51.48 9.21,49.21 9.21,44.45 6.67,41.91 6.67,40.64 6.03,40.01 6.03,28.26 5.08,27.3 3.54,27.3 IC6.17
LED0
  HF 0.203: IC5.28 26.91,62.63 26.67,62.87 26.67,64.45 27.62,65.41 LED2.C
LED1
  HF 0.203: IC5.29 26.41,62.49 26.19,62.71 26.19,64.77 28.73,67.31 LED1.C
MII_COL  (via drill 0.3)
  HF 0.203: IC5.25 30.13,59.98 31.11,60.96 v35.56,60.96 | RN8.2 38.64,55.18 v38.42,55.4
  Signals 0.203: v38.42,55.4 37.47,56.36 37.47,59.05 v35.56,60.96
MII_CRS
  HF 0.203: IC5.22 30.69,58.48 30.96,58.74 30.96,59.37 31.43,59.85 33.5,59.85 35.88,57.47 37.57,57.47 RN9.4
MII_INT  (via drill 0.3)
  HF 0.203: IC7.7 47.56,49.78 45.4,47.62 39.37,47.62 39.21,47.47 39.05,47.31 37.47,47.31 34.92,44.77 v31.43,44.77 | IC5.4 30.85,49.48 31.43,48.9 v31.43,47.31
  Signals 0.203: v31.43,44.77 v31.43,47.31
MII_MDC  (via drill 0.3)
  HF 0.203: IC5.16 28.96,55.48 28.26,54.77 v28.1,54.77 | IC7.31 47.06,58.8 46.67,58.42 v45.09,58.42
  Signals 0.203: v28.1,54.77 29.69,54.77 32.07,52.39 38.73,52.39 44.77,58.42 v45.09,58.42
MII_MDIO  (via drill 0.3)
  HF 0.203: IC7.30 47.56,60.89 47.94,61.28 47.94,61.97 R14.1 v47.31,63.5 | IC5.24 28.79,59.48 28.57,59.69 28.57,60.33 29.84,61.59 v36.2,61.59
  Signals 0.203: v36.2,61.59 38.1,63.5 v47.31,63.5
MII_RX_CLK
  HF 0.203: IC5.23 30.4,58.98 30.48,59.05 30.48,59.53 31.27,60.33 33.66,60.33 34.92,59.05 36.83,59.05 37.22,58.67 RN9.2
MII_RX_DV  (via drill 0.3)
  HF 0.203: IC5.31 25.41,60.63 26.35,59.69 v27.94,59.69 | RN9.3 36.9,58.17 v36.83,58.1
  Signals 0.203: v27.94,59.69 30.48,59.69 31.75,58.42 36.51,58.42 v36.83,58.1
MII_RX_ER  (via drill 0.3)
  HF 0.203: RN8.1 38.97,55.8 38.42,56.36 v36.51,56.36 | IC5.46 17.91,62.67 18.1,62.87 v25.4,62.87
  Signals 0.203: v25.4,62.87 25.4,61.44 27.78,59.05 30.32,59.05 31.43,57.94 34.29,57.94 35.88,56.36 v36.51,56.36
MII_RXD0  (via drill 0.3)
  HF 0.203: IC5.32 24.91,60.5 26.99,58.42 v28.26,58.42 | RN8.3 38.19,54.68 v37.15,55.72
  Signals 0.203: v37.15,55.72 35.72,55.72 34.77,56.67 31.91,56.67 30.16,58.42 v28.26,58.42
MII_RXD1  (via drill 0.3)
  HF 0.203: IC5.33 24.41,60.37 26.99,57.78 v27.62,57.78 | RN8.4 37.86,54.05 v37.15,54.77
  Signals 0.203: v37.15,54.77 36.04,54.77 34.61,56.2 31.75,56.2 30.16,57.78 v27.62,57.78
MII_RXD2  (via drill 0.3)
  HF 0.203: IC5.34 23.91,60.23 26.99,57.15 v28.26,57.15 | RN6.1 37.38,52.63 v36.04,53.98
  Signals 0.203: v36.04,53.98 35.88,54.13 32.23,54.13 29.21,57.15 v28.26,57.15
MII_RXD3  (via drill 0.3)
  HF 0.203: IC5.35 23.41,60.09 26.99,56.52 v27.62,56.52 | RN6.2 37.06,52 v36.04,53.02
  Signals 0.203: v36.04,53.02 35.72,53.02 35.08,53.66 32.07,53.66 29.21,56.52 v27.62,56.52
MII_TX_CLK  (via drill 0.3)
  HF 0.203: RN6.3 37.06,51.5 v36.83,51.28 | IC5.18 28.69,56.48 28.1,55.88 27.62,55.88 26.35,54.61 26.35,53.66 27.62,52.39 v27.62,51.28
  Signals 0.203: 36.51,51.28 v36.83,51.28 v27.62,51.28
MII_TX_EN  (via drill 0.3)
  HF 0.203: IC5.47 17.41,62.81 18.1,63.5 v22.86,63.5 | v35.88,50.01 36.35,50.01 37.23,50.88 RN6.4
  Signals 0.203: v22.86,63.5 22.86,61.44 25.56,58.74 25.56,51.75 26.99,50.32 27.15,50.16 35.72,50.16 v35.88,50.01
MII_TXD0  (via drill 0.3)
  HF 0.203: IC5.51 13.69,59.98 13.34,60.33 13.34,64.77 14.29,65.72 v24.13,65.72 | RN4.1 37.57,49.69 36.67,49.69 34.92,47.94 33.02,47.94 31.75,46.67 29.53,46.67 26.67,49.53 26.67,51.91 v26.83,52.07
  Signals 0.203: v24.13,65.72 24.13,61.44 26.51,59.05 26.51,56.04 26.83,55.72 v26.83,52.07
MII_TXD1  (via drill 0.3)
  HF 0.203: IC5.52 13.55,59.48 12.7,60.33 12.7,64.77 14.29,66.36 v23.5,66.36 | v26.19,52.7 26.19,49.37 29.53,46.04 34.61,46.04 36.2,47.62 36.2,48.58 36.76,49.15 RN4.2
  Signals 0.203: v23.5,66.36 23.5,61.44 26.04,58.9 26.04,52.86 v26.19,52.7
MII_TXD2  (via drill 0.3)
  HF 0.203: IC5.17 28.83,55.98 28.26,55.4 27.78,55.4 26.83,54.45 26.83,53.82 28.26,52.39 v28.26,49.53 | RN4.3 37.06,48.65 v36.99,48.58
  Signals 0.203: v28.26,49.53 35.24,49.53 36.2,48.58 v36.99,48.58
MII_TXD3
  HF 0.203: RN4.4 37.23,48.02 34.61,45.4 31.11,45.4 29.53,43.81 25.72,43.81 25.24,44.29 25.24,45.24 25.41,45.41 IC5.95
N$1  (via drill 0.3)
  HF 0.203: IC9.17 17.42,21.48 v17.94,20.95 | v19.68,30.8 16.58,33.91 RN10.6
  PWR 0.203: v17.94,20.95 17.94,25.56 19.68,27.3 v19.68,30.8
N$2  (via drill 0.3)
  HF 0.203: IC9.16 16.92,21.02 v17.14,20.8 | v17.78,31.43 17.78,32.07 15.95,33.9 RN10.5
  PWR 0.203: v17.14,20.8 17.14,25.4 18.41,26.67 18.41,29.53 17.78,30.16 v17.78,31.43
N$3  (via drill 0.3)
  HF 0.203: IC9.18 18.3,21.59 v18.57,21.59 | v20.32,31.43 19.68,31.43 17.08,34.04 RN10.7
  PWR 0.203: v18.57,21.59 18.57,25.56 20.32,27.3 v20.32,31.43
N$4  (via drill 0.3)
  HF 0.203: IC9.19 18.67,22.29 v19.37,21.59 | v20.95,30.8 20.95,31.75 20.64,32.07 19.68,32.07 17.7,34.05 RN10.8 17.7,34.69
  PWR 0.203: v19.37,21.59 19.05,21.91 19.05,25.4 20.95,27.3 v20.95,30.8
N$5
  HF 0.203: IC9.7 14.47,25.22 13.34,26.35 12.7,26.35 12.06,26.99 12.06,30.48 14.37,32.78 RN11.8
N$6
  HF 0.203: IC5.73 11.29,48.98 C18.1
N$7
  HF 0.203: IC9.8 14.17,24.72 13.02,25.88 12.54,25.88 11.43,26.99 11.43,30.8 12.62,31.99 RN11.5
N$9  (via drill 0.3)
  HF 0.203: IC2.48 28.89,80.22 v28.89,80.96 | v36.2,76.52 IC4.5
  Signals 0.203: v28.89,80.96 31.43,78.42 35.24,78.42 36.2,77.47 v36.2,76.52
N$10  (via drill 0.3)
  HF 0.203: IC2.1 29.12,81.67 v29.83,80.96 v29.84,80.96 | v36.2,78.42 36.2,78.22 IC4.4
  Signals 0.203: v29.84,80.96 31.75,79.06 35.56,79.06 v36.2,78.42
N$11
  HF 0.203: IC7.3 45.56,50.32 44.77,49.53 39.69,49.53 39.45,49.77 RN4.8
N$12
  HF 0.203: IC7.4 46.06,50.19 44.93,49.05 39.37,49.05 39.28,49.15 RN4.7
N$13
  HF 0.203: IC7.5 46.56,50.05 45.09,48.58 39.05,48.58 38.98,48.65 RN4.6
N$14  (via drill 0.3)
  HF 0.203: IC2.2 27.33,80.94 v27.62,80.64 | IC4.3 38.9,77.47 38.1,78.26 38.1,79.8 R7.2 36.93,80.96 v36.2,80.96
  Signals 0.203: v27.62,80.64 28.89,81.92 29.84,81.92 30.8,80.96 v36.2,80.96
N$15
  HF 0.203: IC7.6 47.06,49.91 45.24,48.1 39.05,48.1 38.97,48.02 RN4.5
N$16
  HF 0.203: IC7.1 44.56,50.75 44.29,50.48 40.32,50.48 39.3,51.5 RN6.6
N$17
  HF 0.203: IC7.2 45.06,50.45 44.61,50.01 40.01,50.01 39.13,50.88 RN6.5
N$18
  HF 0.203: IC7.45 41.93,54.31 40.96,53.34 40.32,53.34 39.61,52.63 RN6.8
N$20
  HF 0.203: R22.1 27.62,37.2 27.62,39.05 26.99,39.69 25.72,39.69 25.4,40.01 25.4,41.95 LED3.A
N$28
  HF 0.203: IC2.44 31.17,78.22 R5.1 31.69,78.74 33.27,78.74 Q1.3
N$29
  HF 0.203: IC4.1 39.69,75.57 40.32,76.2 40.32,77.69 R8.1 R7.1
N$30
  HF 0.203: RN6.7 39.62,52 40.32,52.7 40.96,52.7 42.06,53.81 IC7.46
N$31
  HF 0.203: IC5.48 16.91,64.48 C17.1
N$32
  HF 0.203: IC7.43 41.66,55.31 41.02,54.68 RN8.6
N$33
  HF 0.203: IC7.44 41.8,54.81 41.03,54.05 RN8.5
N$34
  HF 0.203: IC7.42 41.52,55.81 40.89,55.18 RN8.7
N$35
  HF 0.203: IC7.41 41.39,56.31 40.88,55.8 RN8.8
N$36
  HF 0.203: IC7.39 41.75,57.31 40.89,58.17 RN9.6
N$37
  HF 0.203: IC7.38 41.88,57.81 41.02,58.67 RN9.7
N$38
  HF 0.203: IC7.40 41.61,56.81 40.88,57.55 RN9.5
N$39
  HF 0.203: IC7.24 51.96,58.31 52.86,59.21 52.86,62.23 53.98,63.34 R17.2
N$40  (via drill 0.3)
  HF 0.203: IC7.18 52.64,55.31 53.34,54.61 v53.82,54.61 C30.1 | IC7.23 52.41,57.81 53.34,58.74 53.34,59.85 53.98,60.48 C31.1 C32.1 v53.82,61.91 | 43.11,59.66 C29.1 | 43.11,59.66 43.18,59.73 v43.18,60.64 | IC7.37 43.11,59.66
  Signals 0.203: v53.82,61.91 53.34,61.44 53.34,60.64 53.82,60.17 v53.82,54.61 52.07,54.61 51.75,54.29 49.85,54.29 49.53,54.61 49.53,57.78 46.67,60.64 v43.18,60.64
N$41
  HF 0.203: IC7.20 54.44,56.31 R15.1
N$42
  HF 0.203: IC7.21 51.53,56.83 53.02,56.83 53.66,57.47 R16.1
N$43  (via drill 0.3)
  HF 0.203: RN7.3 38.98,66.61 v39.37,66.99 | ETH.12 52.9,78.3 52.07,77.47 52.07,69.22 50.8,67.94 50.8,64.77 49.56,63.53 IC7.26
  Signals 0.203: v39.37,66.99 39.94,66.99 ETH.12
N$44
  HF 0.203: 40.96,83.82 44.45,83.82 46.99,81.28 46.99,68.9 48.26,67.63 48.26,64.45 49.06,63.66 IC7.27 | 40.96,83.82 100MBIT.C | RN7.2 40.07,66.11 42.55,68.58 42.55,73.34 40.96,74.93 40.96,83.82
N$46
  HF 0.203: 43.18,65.41 46.2,65.41 48.56,63.04 IC7.28 | 43.18,65.41 43.18,71.75 45.72,74.3 45.72,76.52 42.29,79.95 ETH.14 | RN7.1 38.63,65.41 43.18,65.41
N$47  (via drill 0.3)
  HF 0.203: v50.16,57.78 48.58,56.2 48.58,53.82 49.85,52.55 50.64,52.55 50.91,52.81 IC7.13 52.12,52.81 52.78,52.15 RN5.4
  Signals 0.203: v50.16,57.78 50.16,63.5 46.9,66.76 ETH.6
N$48
  HF 0.406: R6.1 17.88,83.72 PWR.A
N$49  (via drill 0.3)
  HF 0.203: v50.16,56.83 49.05,55.72 49.05,53.98 50.01,53.02 50.32,53.02 50.61,53.31 IC7.14 52.41,53.31 53.41,52.32 RN5.3
  Signals 0.203: v50.16,56.83 50.8,57.47 50.8,64.77 49.44,66.13 ETH.4
N$50  (via drill 0.3)
  HF 0.203: v50.16,55.88 49.53,55.24 49.53,54.61 49.83,54.31 IC7.16 52.37,54.31 53.91,52.77 RN5.2
  Signals 0.203: v50.16,55.88 51.44,57.15 51.44,65.41 50.71,66.13 ETH.3
N$51  (via drill 0.3)
  HF 0.203: v50.16,54.93 50.28,54.81 IC7.17 52.5,54.81 54.53,52.78 RN5.1
  Signals 0.203: v50.16,54.93 52.7,57.47 52.7,66.04 53.25,66.59 ETH.1
N$52
  HF 0.203: R11.1 36.08,82.26 100MBIT.A
N$53  (via drill 0.3)
  HF 0.203: R12.1 38.16,72.39 v38.73,72.39
  Signals 0.203: v38.73,72.39 38.73,74.61 44.07,79.95 ETH.13
N$54  (via drill 0.3)
  HF 0.203: R13.1 v39.05,70.8
  Signals 0.203: ETH.11 54.1,81.28 52.07,81.28 41.59,70.8 v39.05,70.8
N$55
  HF 0.203: IC7.34 45.56,62.08 45.09,62.55 43.66,62.55 42.65,63.56 Q3.3
N$56
  HF 0.203: IC1.4 18.39,69.22 16.83,69.22 15,67.39 RN2.1
N$67
  HF 0.203: R10.1 LED2.A
N$68
  HF 0.203: R9.1 LED1.A
N$71
  HF 0.203: IC2.40 28.28,76.22 27.78,75.72 27.78,74.45 28.65,73.58 RN3.4
N$72
  HF 0.203: IC2.39 28.41,75.72 28.26,75.56 28.26,74.61 30.4,72.47 RN3.1
N$73
  HF 0.406: 3.49,69.22 C15.1 | 3.49,69.22 L3.1 | IC6.2 3.49,65.35 3.49,69.22
N$74
  HF 0.203: IC9.6 15.42,26.17 14.92,26.67 14.24,26.67 Q4.1
N$75
  HF 0.203: IC9.4 16.42,26.58 16.51,26.67 16.51,28.42 15.5,29.43 Q4.3
N$76
  HF 0.643: C33.1 R19.1 arc90 24.42,24.3 C41.1 arc-90 23.32,24.29 R18.2
N$77
  HF 0.643: C38.2 arc90 27.91,24.3 C42.1 arc-90 26.81,24.29 R19.2 C33.2
N$78
  HF 0.203: IC9.1 17.92,26.17 18.73,26.99 19.05,27.29 C56.1
N$79  (via drill 0.3)
  HF 0.203: IC9.2 17.42,26.63 v17.62,26.83 17.94,27.15 C46.1 | 14.62,22.72 IC9.12 14.47,22.72 v13.97,22.23 13.65,22.23 13.03,21.61 C45.1
  PWR 0.203: v17.62,26.83 | v17.62,26.83 16.83,27.62 15.24,27.62 13.97,26.35 13.97,22.38 v13.97,22.23
N$80
  HF 0.254: IC8.21 29.54,24.52 C38.1
N$82
  HF 0.643: C39.2 37.16,15.54 C43.1 37.16,13.03 R20.1
N$83
  HF 0.643: R20.2 37.16,11.73 C44.1 37.15,10.48 37.15,4.15 X2.C
N$84
  HF 0.643: C47.2 19.22,15.54 C48.1 19.22,13.03 R21.1
N$85
  HF 0.643: R21.2 19.22,11.73 C49.1 19.21,10.48 19.21,4.21 X3.C
N$86
  HF 0.305: 34.72,24.02 IC8.8
  HF 0.643: C39.1 37.15,21.27 arc90 34.72,24.02
N$87
  HF 0.305: 33.07,22.43 IC8.6
  HF 0.643: C47.1 arc-90 21.73,19.37 30.48,19.37 arc90 33.07,21.95 33.07,22.43
N$103
  HF 0.203: R4.2 24.83,83.31 IC2.7 24.83,80.71 24.45,80.33 21.91,80.33 21.59,80.64 18.52,80.64 17.46,79.59 17.46,76.3 R3.2
N$104
  HF 0.203: IC2.8 24.33,81.01 24.13,80.8 22.07,80.8 21.75,81.12 18.36,81.12 16.83,79.59 16.83,77.15 15.56,75.88 R2.2
N$105
  HF 0.203: IC2.5 25.83,82.19 26.19,82.55 26.19,82.97 R4.1
N$106
  HF 0.203: IC2.6 25.33,82.32 25.72,82.71 25.72,84.14 25.4,84.45 24.03,84.45 C2.1
N$108
  HF 0.406: L1.1 13.76,77.52 C8.1 13.3,79.51 USB1.1
N$109
  HF 0.203: R2.1 12.7,76.94 12.7,79.38 12.54,79.53 12.54,80.82 USB1.2
N$110
  HF 0.203: R3.1 12.22,75.83 12.22,79.22 11.91,79.53 11.91,80.83 USB1.3
N$111
  HF 0.203: IC2.46 29.85,79.22 30.16,79.53 30.16,80.38 C1.1 32.59,81.5 R1.1
N$112
  HF 0.203: IC2.43 30.17,77.72 R5.2 31.69,76.2 33.27,76.2 Q1.1
OSC32_IN
  HF 0.203: IC5.8 32.66,51.48 33.34,50.8 33.67,50.8 Q2.1 C12.1
OSC32_OUT
  HF 0.203: IC5.9 32.61,51.98 33.34,52.7 33.67,52.7 Q2.2 C13.1
PHY_RESET  (via drill 0.3)
  HF 0.203: IC5.30 25.91,60.77 26.35,60.33 27.78,60.33 29.69,62.23 36.83,62.23 v37.47,61.59 | IC7.29 48.06,58.85 v47.62,58.42
  Signals 0.203: v47.62,58.42 46.67,59.37 41.91,59.37 40.96,60.33 38.73,60.33 v37.47,61.59
RFIO1
  HF 0.254: IC9.22 19.84,24.22 C40.1
  HF 0.643: R18.1 arc90 20.93,24.3 C40.1
SPI2_MISO  (via drill 0.3)
  HF 0.203: IC5.53 15.64,58.98 19.68,54.93 v19.68,51.44
  Signals 0.203: v19.68,51.44 18.41,50.16 16.19,50.16 14.29,48.26 11.43,48.26 6.67,43.5 6.67,38.05 IC6.33
SPI2_MOSI  (via drill 0.3)
  HF 0.203: IC5.54 15.5,58.48 19.05,54.93 v19.05,52.07 | v11.43,52.07 10.48,52.07 7.94,49.53 7.94,44.45 4.77,41.28 IC6.31
  Signals 0.203: v11.43,52.07 v19.05,52.07
SPI2_SCK  (via drill 0.3)
  HF 0.203: IC5.71 13.21,49.98 v13.02,50.16
  Signals 0.203: IC6.29 6.62,46.31 10.48,50.16 v13.02,50.16
SPI3_MISO  (via drill 0.3)
  HF 0.203: RN10.4 15.95,36.28 v15.4,36.83 | v17.46,43.81 17.41,43.87 IC5.79
  PWR 0.203: v15.4,36.83 17.14,38.58 17.14,43.5 v17.46,43.81
SPI3_MOSI  (via drill 0.3)
  HF 0.203: RN10.3 16.58,36.6 v16.35,36.83 | v18.41,43.81 17.91,44.32 IC5.80
  PWR 0.203: v16.35,36.83 17.78,38.26 17.78,43.18 v18.41,43.81
SPI3_SCK  (via drill 0.3)
  HF 0.203: RN10.2 17.08,36.6 v17.3,36.83 | v18.41,42.86 17.46,42.86 16.83,43.5 16.83,44.45 16.91,44.53 IC5.78
  PWR 0.203: v17.3,36.83 18.41,37.94 v18.41,42.86
SRST  (via drill 0.3)
  HF 0.203: RESET1.3 55.43,6.47 | v56.83,6.35 55.34,6.35 RESET1.3 | RESET1.3 55.3,6.35 46.24,6.35 RESET1.4 46.22,7.43 v46.04,7.62 | IC2.15 20.32,79.22 19.84,78.74 18.41,78.74 18.1,78.42 18.1,75.25 15.88,73.03 v15.56,73.03 14.85,72.31 RN1.4 | IC5.14 28.92,54.48 28.57,54.13 v27.46,54.13 | v17.14,67.63 C14.1
  Signals 0.203: v15.56,73.03 14.92,72.39 14.92,69.85 v17.14,67.63 17.46,67.31 23.5,67.31 24.77,66.04 24.77,61.44 26.99,59.21 26.99,56.2 27.46,55.72 v27.46,54.13 27.46,51.91 26.99,51.44 26.99,50.96 27.3,50.64 38.42,50.64 43.81,45.24 43.81,9.84 v46.04,7.62
SW-OUT
  HF 0.406: IC3.5 8.89,74.3 10.16,73.03 L2.P$2
SWCLK  (via drill 0.3)
  HF 0.203: RN2.6 13.24,68.51 v13.18,68.58 | IC5.76 15.91,47.02 16.51,47.62 v17.94,47.62
  Signals 0.203: v17.94,47.62 21.91,47.62 24.13,49.85 24.13,58.26 16.03,66.36 14.61,66.36 13.18,67.79 v13.18,68.58
SWCLK1  (via drill 0.3)
  HF 0.203: IC2.24 20.11,74.72 19.05,73.66 18.41,73.66 v16.83,72.07 16.83,69.85 15.49,68.51 RN2.3 | RN1.3 15.17,71.69 v15.56,72.07
  Signals 0.203: v16.83,72.07 v15.56,72.07
SWDIO  (via drill 0.3)
  HF 0.203: RN2.5 12.94,69.14 12.38,68.58 12.38,67.31 | RN2.8 13.76,67.31 12.38,67.31 | IC5.72 14.98,49.48 16.19,48.26 v18.57,48.26 | v12.38,66.67 12.38,67.31
  Signals 0.203: v18.57,48.26 21.91,48.26 23.65,50.01 23.65,58.1 21.27,60.48 16.03,65.72 13.34,65.72 v12.38,66.67
SWDIO_OE  (via drill 0.3)
  HF 0.203: IC2.21 21.57,76.22 22.23,75.56 22.23,74.3 20.32,72.39 IC1.1 20.32,71.12 v19.37,70.17 | RN1.1 14.81,70.48 15.24,70.48 v15.56,70.17
  Signals 0.203: v15.56,70.17 v19.37,70.17
TP_CS  (via drill 0.3)
  HF 0.203: IC5.63 15.24,53.98 15.4,53.82 v15.4,50.8
  Signals 0.203: v15.4,50.8 14.13,49.53 10.53,49.53 IC6.30
TP_IRQ  (via drill 0.3)
  HF 0.203: IC5.59 15.14,55.98 16.19,54.93 16.19,49.85 v17.14,48.9
  Signals 0.203: v17.14,48.9 16.51,48.9 12.06,44.45 11.11,44.45 7.94,41.27 7.94,36.78 IC6.34
USART1_RX  (via drill 0.3)
  HF 0.203: IC5.93 24.41,47.9 v25.08,48.58 | v22.23,64.77 24.13,64.77 28.65,69.29 RN3.5
  Signals 0.203: v25.08,48.58 25.08,58.58 22.23,61.44 v22.23,64.77
USART1_TX  (via drill 0.3)
  HF 0.203: IC5.92 23.91,48.35 v24.13,48.58 | v21.59,64.14 24.13,64.14 30.4,70.41 RN3.8
  Signals 0.203: v24.13,48.58 24.13,48.9 24.61,49.37 24.61,58.42 21.59,61.44 v21.59,64.14
VBAT  (via drill 0.3)
  HF 0.203: IC5.6 31.44,50.48 32.7,49.21 v32.7,48.58 | 51.44,37.15 X1.POS1 | X1.POS2 51.44,14.29 48.58,17.14 48.58,34.29 51.44,37.15 | v42.55,37.47 51.12,37.47 51.44,37.15
  Signals 0.203: v32.7,48.58 32.7,46.35 35.88,43.18 40.64,43.18 42.55,41.27 v42.55,37.47
WF1_BUSY  (via drill 0.3)
  HF 0.203: RN11.1 14.37,36.43 v14.13,36.67 | v14.29,42.23 18.73,42.23 19.41,42.9 IC5.83
  PWR 0.203: v14.13,36.67 14.29,36.83 v14.29,42.23
WF1_CS  (via drill 0.3)
  HF 0.203: RN10.1 17.7,36.28 v18.26,36.83 | v21.27,41.91 21.41,42.05 IC5.87
  PWR 0.203: v18.26,36.83 21.27,39.85 v21.27,41.91
WF1_IRQ  (via drill 0.3)
  HF 0.203: RN11.4 12.62,36.44 v12.38,36.67 | v13.02,41.59 18.73,41.59 19.91,42.77 IC5.84
  PWR 0.203: v12.38,36.67 13.02,37.31 v13.02,41.59
WF_3V3
  HF 0.203: L4.1 25.08,31.8 25.08,32.65 C57.1 25.88,32.6 25.88,31.64 L5.1
  HF 0.406: C57.1 25.56,33.12 IC10.5 25.56,34.77 27.15,34.77 R22.2
WF_3V3FEM  (via drill 0.3)
  HF 0.203: IC8.16 31.57,27.82 C55.1 C54.1 31.01,30.42 v30.8,30.64 | IC8.14 32.57,26.85 32.86,27.15 32.86,27.93 32.65,28.14 C53.1 | C53.1 32.54,28.27 | C52.1 32.54,29.51 | C51.1 35.89,25.72 | IC8.11 35.57,25.52 C51.1 | C51.1 36.14,25.56 37.05,25.56 C50.1 37.52,26.04 v38.26,26.04 | IC8.3 31.57,22.36 v31.43,22.23 | IC8.19 29.57,25.52 v29.37,25.72 | C52.1 32.38,29.95 v32.38,30.64 | L5.2 28.57,31.68 v28.57,32.07 | C52.1 C53.1
  PWR 0.203: v31.43,22.23 31.43,22.07 30.96,21.59 30.32,21.59 29.37,22.54 v29.37,25.72 28.89,26.19 28.89,29.53 28.57,29.84 28.57,31.11 | v38.26,26.04 38.26,28.57 34.13,32.7 29.21,32.7 v28.57,32.07 | v32.38,30.64 31.75,31.27 29.37,31.27 v28.57,32.07 | 28.57,31.11 v28.57,32.07 | v30.8,30.64 29.05,30.64 28.57,31.11
WF_3V3SX  (via drill 0.3)
  HF 0.203: IC9.11 13.23,23.22 C35.1 13.03,23.16 12.86,23.18 12.86,24.19 C34.1 12.54,24.5 v12.54,25.24 | IC9.15 16.42,21.04 C37.1 C36.1 14.61,20.64 14.29,20.32 v13.65,20.32 | IC9.3 16.92,28.8 16.83,28.89 v16.83,29.69 | L4.2 22.23,31.68 v22.23,32.07
  PWR 0.203: v16.83,29.69 16.83,31.43 17.46,32.07 v22.23,32.07 | v13.65,20.32 13.34,20.64 13.34,28.57 17.46,32.7 21.59,32.7 v22.23,32.07 | v12.54,25.24 12.54,28.42 17.46,33.34 21.91,33.34 22.23,33.02 v22.23,32.07
WF_ANT  (via drill 0.3)
  HF 0.203: RN12.1 34.69,36.91 v35.24,37.47 | IC5.5 30.99,49.98 32.07,48.9 v32.07,47.94
  PWR 0.203: v35.24,37.47 32.07,40.64 v32.07,41.91
  Signals 0.203: v32.07,41.91 v32.07,47.94
WF_CPS  (via drill 0.3)
  HF 0.203: RN12.3 33.56,37.24 v33.34,37.47 | IC5.1 30.13,47.98 30.16,47.94 v30.16,47.31
  PWR 0.203: v33.34,37.47 30.16,40.64 v30.16,42.55
  Signals 0.203: v30.16,42.55 v30.16,47.31
WF_CRX  (via drill 0.3)
  HF 0.203: RN12.2 34.06,37.24 v34.29,37.47 | IC5.3 30.4,48.98 30.8,48.58 v30.8,47.94
  PWR 0.203: v34.29,37.47 30.8,40.96 v30.8,41.91
  Signals 0.203: v30.8,41.91 v30.8,47.94
WF_CTX  (via drill 0.3)
  HF 0.203: RN12.4 32.94,36.91 v32.38,37.47 | IC5.2 28.52,48.48 v27.46,49.53
  PWR 0.203: v32.38,37.47 28.57,41.27 v28.57,41.91
  Signals 0.203: v27.46,49.53 28.57,48.42 v28.57,41.91
WF_ON  (via drill 0.3)
  HF 0.203: IC10.3 23.65,37.62 v22.86,37.62 | v22.86,41.91 22.86,43.81 23.41,44.36 IC5.91
  PWR 0.203: v22.86,37.62 v22.86,41.91

## Text on the board
tStop: TIGERs Mannheim | Base Station v3b | Design: A.Ryll